# Altium schematic sheet Gremar_FController.SchDoc
size A4; SheetNumber: 1; SheetTotal: 1
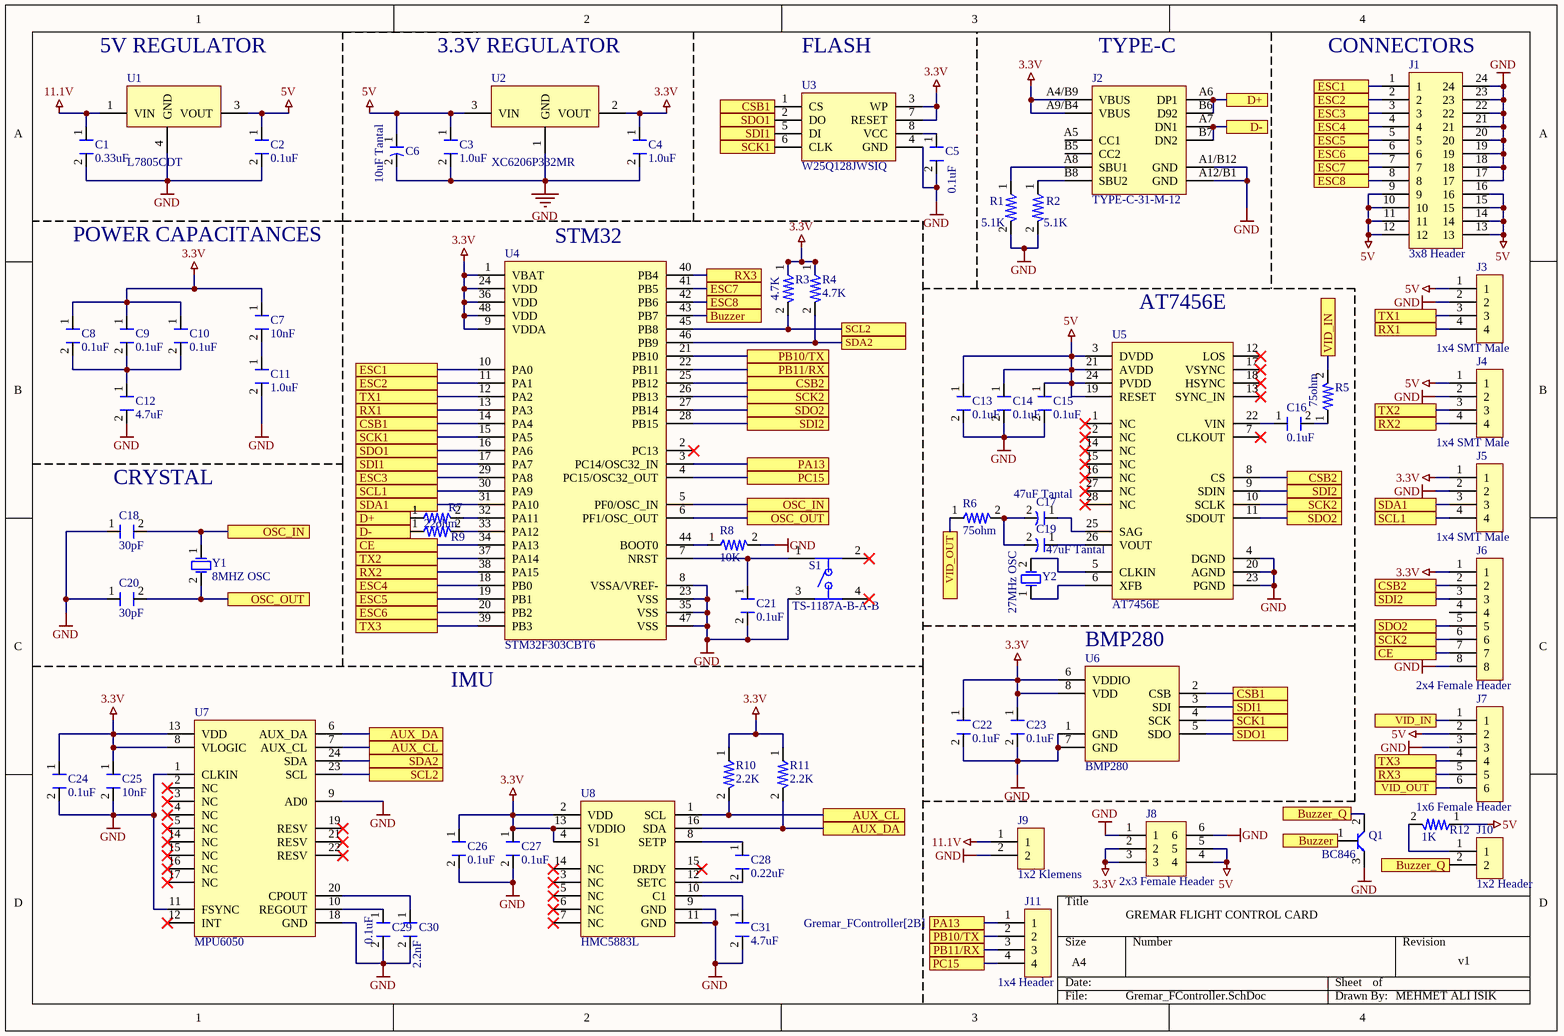
[diagram p0: Gremar_FController.SchDoc]

## Parts
C1  0.33uF  [CAP - 0603]
C2  0.1uF  [CAP - 0603]
C3  1.0uF  [CAP - 0603]
C4  1.0uF  [CAP - 0603]
C5  0.1uF  [CAP - 0603]
C6  10uF Tantal  [10uF Tantal]
C7  10nF  [CAP - 0603]
C8  0.1uF  [CAP - 0603]
C9  0.1uF  [CAP - 0603]
C10  0.1uF  [CAP - 0603]
C11  1.0uF  [CAP - 0603]
C12  4.7uF  [CAP - 0603]
C13  0.1uF  [CAP - 0603]
C14  0.1uF  [CAP - 0603]
C15  0.1uF  [CAP - 0603]
C16  0.1uF  [CAP - 0603]
C17  47uF Tantal  [10uF Tantal]
C18  30pF  [CAP - 0603]
C19  47uF Tantal  [10uF Tantal]
C20  30pF  [CAP - 0603]
C21  0.1uF  [CAP - 0603]
C22  0.1uF  [CAP - 0603]
C23  0.1uF  [CAP - 0603]
C24  0.1uF  [CAP - 0603]
C25  10nF  [CAP - 0603]
C26  0.1uF  [CAP - 0603]
C27  0.1uF  [CAP - 0603]
C28  0.22uF  [CAP - 0603]
C29  0.1uF  [CAP - 0603]
C30  2.2nF  [CAP - 0603]
C31  4.7uF  [CAP - 0603]
J1  3x8 Header  [3x8 Header]
J2  TYPE-C-31-M-12  [TYPE-C-31-M-12]
J3  1x4 SMT Male  [1x4 SMT Header]
J4  1x4 SMT Male  [1x4 SMT Header]
J5  1x4 SMT Male  [1x4 SMT Header]
J6  2x4 Female Header  [2x4 Female Header]
J7  1x6 Female Header  [1x6 FEMALE HEADER]
J8  2x3 Female Header  [2x3 Male Header]
J9  1x2 Klemens  [1x2 Klemens]
J10  1x2 Header  [1x2 Header]
J11  1x4 Header  [1x4 Header]
Q1  BC846  [BC846]
R1  5.1K  [RES - 0603]
R2  5.1K  [RES - 0603]
R3  4.7K  [RES - 0603]
R4  4.7K  [RES - 0603]
R5  75ohm  [RES - 0603]
R6  75ohm  [RES - 0603]
R7  22ohm  [RES - 0603]
R8  10K  [RES - 0603]
R9  22ohm  [RES - 0603]  (value not drawn)
R10  2.2K  [RES - 0603]
R11  2.2K  [RES - 0603]
R12  1K  [RES - 0603]
S1  TS-1187A-B-A-B  [TS-1187A-B-A-B]
U1  L7805CDT  [L7805CDT-TR]
U2  XC6206P332MR  [XC6206P332MR]
U3  W25Q128JWSIQ  [W25Q128JWSIQ]
U4  STM32F303CBT6  [STM32F303CBT6]
U5  AT7456E  [AT7456E]
U6  BMP280  [BMP280]
U7  MPU6050  [MPU-6050]
U8  HMC5883L  [HMC5883L]
Y1  8MHZ OSC  [8MHZ RESONATOR]
Y2  27MHz OSC  [27MHZ OSC - 7A27000010]

## Ports
AUX_CL (see Gremar_FController[1C]), AUX_CL (see Gremar_FController[3D]), AUX_DA (see Gremar_FController[1C]), AUX_DA (see Gremar_FController[3D]), Buzzer (see Gremar_FController[2B]), Buzzer (see Gremar_FController[4D]), Buzzer_Q (see Gremar_FController[4D]), CE (see Gremar_FController[1C]), CE (see Gremar_FController[4C]), CSB1 (see Gremar_FController[1B], Gremar_FController[2A]), CSB1 (see Gremar_FController[1B], Gremar_FController[4C]), CSB1 (see Gremar_FController[2A], Gremar_FController[4C]), CSB2 (see Gremar_FController[2B], Gremar_FController[4B]), CSB2 (see Gremar_FController[2B], Gremar_FController[4C]), CSB2 (see Gremar_FController[4B], Gremar_FController[4C]), D+ (see Gremar_FController[1C]), D+ (see Gremar_FController[4A]), D- (see Gremar_FController[1C]), D- (see Gremar_FController[4A]), ESC1 (see Gremar_FController[1B]), ESC1 (see Gremar_FController[4A]), ESC2 (see Gremar_FController[1B]), ESC2 (see Gremar_FController[4A]), ESC3 (see Gremar_FController[1B]), ESC3 (see Gremar_FController[4A]), ESC4 (see Gremar_FController[1C]), ESC4 (see Gremar_FController[4A]), ESC5 (see Gremar_FController[1C]), ESC5 (see Gremar_FController[4A]), ESC6 (see Gremar_FController[1C]), ESC6 (see Gremar_FController[4A]), ESC7 (see Gremar_FController[2B]), ESC7 (see Gremar_FController[4A]), ESC8 (see Gremar_FController[2B]), ESC8 (see Gremar_FController[4A]), OSC_IN (see Gremar_FController[1C]), OSC_IN (see Gremar_FController[2B]), OSC_OUT (see Gremar_FController[1C]), OSC_OUT (see Gremar_FController[2C]), PA13 (see Gremar_FController[2B]), PA13 (see Gremar_FController[3D]), PB10/TX (see Gremar_FController[2B]), PB10/TX (see Gremar_FController[3D]), PB11/RX (see Gremar_FController[2B]), PB11/RX (see Gremar_FController[3D]), PC15 (see Gremar_FController[2B]), PC15 (see Gremar_FController[3D]), RX1 (see Gremar_FController[1B]), RX1 (see Gremar_FController[4B]), RX2 (see Gremar_FController[1C]), RX2 (see Gremar_FController[4B]), RX3 (see Gremar_FController[2B]), RX3 (see Gremar_FController[4D]), SCK1 (see Gremar_FController[1B], Gremar_FController[2A]), SCK1 (see Gremar_FController[1B], Gremar_FController[4C]), SCK1 (see Gremar_FController[2A], Gremar_FController[4C]), SCK2 (see Gremar_FController[2B], Gremar_FController[4B]), SCK2 (see Gremar_FController[2B], Gremar_FController[4C]), SCK2 (see Gremar_FController[4B], Gremar_FController[4C]), SCL1 (see Gremar_FController[1B]), SCL1 (see Gremar_FController[4C]), SCL2 (see Gremar_FController[1D]), SCL2 (see Gremar_FController[3B]), SDA1 (see Gremar_FController[1B]), SDA1 (see Gremar_FController[4B]), SDA2 (see Gremar_FController[1C]), SDA2 (see Gremar_FController[3B]), SDI1 (see Gremar_FController[1B], Gremar_FController[2A]), SDI1 (see Gremar_FController[1B], Gremar_FController[4C]), SDI1 (see Gremar_FController[2A], Gremar_FController[4C]), SDI2 (see Gremar_FController[2B], Gremar_FController[4B]), SDI2 (see Gremar_FController[2B], Gremar_FController[4C]), SDI2 (see Gremar_FController[4B], Gremar_FController[4C]), SDO1 (see Gremar_FController[1B], Gremar_FController[2A]), SDO1 (see Gremar_FController[1B], Gremar_FController[4C]), SDO1 (see Gremar_FController[2A], Gremar_FController[4C]), SDO2 (see Gremar_FController[2B], Gremar_FController[4C]), SDO2 (see Gremar_FController[4C]), TX1 (see Gremar_FController[1B]), TX1 (see Gremar_FController[4B]), TX2 (see Gremar_FController[1C]), TX2 (see Gremar_FController[4B]), TX3 (see Gremar_FController[1C]), TX3 (see Gremar_FController[4C]), VID_IN (see Gremar_FController[4B]), VID_IN (see Gremar_FController[4C]), VID_OUT (see Gremar_FController[3C]), VID_OUT (see Gremar_FController[4D])

## Nets
3.3V: C4.1 C7.1 C8.1 C9.1 C10.1 C22.1 C23.1 C24.1 C25.1 C26.1 C27.1 J2.A4/B9(VBUS) J2.A9/B4(VBUS) J5.1 J6.1 J8.2 J8.3 R3.1 R4.1 R10.1 R11.1 U2.2(VOUT) U3.3(WP) U3.7(RESET) U4.1(VBAT) U4.9(VDDA) U4.24(VDD) U4.36(VDD) U4.48(VDD) U6.6(VDDIO) U6.8(VDD) U7.8(VLOGIC) U7.13(VDD) U8.2(VDD) U8.4(S1) U8.13(VDDIO)
5V: C2.1 C3.1 C6.1 C13.1 C14.1 C15.1 J1.9 J1.10 J1.11 J1.12 J1.13 J1.14 J1.15 J1.16 J3.1 J4.1 J7.2 J8.4 J8.5 R12.1 U1.3(VOUT) U2.3(VIN) U5.3(DVDD) U5.19(RESET) U5.21(AVDD) U5.24(PVDD)
11.1V: C1.1 J9.1 U1.1(VIN)
GND: C1.2 C2.2 C3.2 C4.2 C5.2 C6.2 C11.2 C12.2 C13.2 C14.2 C15.2 C18.1 C20.1 C21.2 C22.2 C23.2 C24.2 C25.2 C26.2 C27.2 C29.2 C30.2 C31.2 J1.17 J1.18 J1.19 J1.20 J1.21 J1.22 J1.23 J1.24 J2.A1/B12(GND) J2.A12/B1(GND) J3.2 J4.2 J5.2 J6.8 J7.3 J8.1 J8.6 J9.2 Q1.3 R1.2 R2.2 R8.2 S1.3 U1.4(GND) U2.1(GND) U3.4(GND) U4.8(VSSA/VREF-) U4.23(VSS) U4.35(VSS) U4.47(VSS) U5.4(DGND) U5.20(AGND) U5.23(PGND) U6.1(GND) U6.7(GND) U7.1(CLKIN) U7.9(AD0) U7.11(FSYNC) U7.18(GND) U8.9(GND) U8.11(GND)
AUX_CL: R10.2 U7.7(AUX_CL) U8.1(SCL) ; port AUX_CL
AUX_DA: R11.2 U7.6(AUX_DA) U8.16(SDA) ; port AUX_DA
Buzzer: Q1.1 U4.43(PB7) ; port Buzzer
Buzzer_Q: J10.2 Q1.2 ; port Buzzer_Q
CE: J6.7 U4.34(PA13) ; port CE
CSB1: U3.1(CS) U4.14(PA4) U6.2(CSB) ; port CSB1
CSB2: J6.2 U4.25(PB12) U5.8(CS) ; port CSB2
D+: J2.A6(DP1) J2.B6(D92) R7.1 ; port D+
D-: J2.A7(DN1) J2.B7(DN2) R9.1 ; port D-
ESC1: J1.1 U4.10(PA0) ; port ESC1
ESC2: J1.2 U4.11(PA1) ; port ESC2
ESC3: J1.3 U4.29(PA8) ; port ESC3
ESC4: J1.4 U4.18(PB0) ; port ESC4
ESC5: J1.5 U4.19(PB1) ; port ESC5
ESC6: J1.6 U4.20(PB2) ; port ESC6
ESC7: J1.7 U4.41(PB5) ; port ESC7
ESC8: J1.8 U4.42(PB6) ; port ESC8
OSC_IN: C18.2 U4.5(PF0/OSC_IN) Y1.1 ; port OSC_IN
OSC_OUT: C20.2 U4.6(PF1/OSC_OUT) Y1.2 ; port OSC_OUT
PA13: J11.1 U4.3(PC14/OSC32_IN) ; port PA13
PB10/TX: J11.2 U4.21(PB10) ; port PB10/TX
PB11/RX: J11.3 U4.22(PB11) ; port PB11/RX
PC15: J11.4 U4.4(PC15/OSC32_OUT) ; port PC15
RX1: J3.4 U4.13(PA3) ; port RX1
RX2: J4.4 U4.38(PA15) ; port RX2
RX3: J7.5 U4.40(PB4) ; port RX3
SCK1: U3.6(CLK) U4.15(PA5) U6.4(SCK) ; port SCK1
SCK2: J6.6 U4.26(PB13) U5.10(SCLK) ; port SCK2
SCL1: J5.4 U4.30(PA9) ; port SCL1
SCL2: R3.2 U4.45(PB8) U7.23(SCL) ; port SCL2
SDA1: J5.3 U4.31(PA10) ; port SDA1
SDA2: R4.2 U4.46(PB9) U7.24(SDA) ; port SDA2
SDI1: U3.5(DI) U4.17(PA7) U6.3(SDI) ; port SDI1
SDI2: J6.3 U4.28(PB15) U5.9(SDIN) ; port SDI2
SDO1: U3.2(DO) U4.16(PA6) U6.5(SDO) ; port SDO1
SDO2: J6.5 U4.27(PB14) U5.11(SDOUT) ; port SDO2
TX1: J3.3 U4.12(PA2) ; port TX1
TX2: J4.3 U4.37(PA14) ; port TX2
TX3: J7.4 U4.39(PB3) ; port TX3
VID_IN: J7.1 R5.2 ; port VID_IN
VID_OUT: J7.6 R6.1 ; port VID_OUT
NetC5_1: C5.1 U3.8(VCC)
NetC7_2: C7.2 C11.1
NetC8_2: C8.2 C9.2 C10.2 C12.1
NetC16_1: C16.1 U5.22(VIN)
NetC16_2: C16.2 R5.1
NetC17_1: C17.1 U5.25(SAG)
NetC17_2: C17.2 C19.2 R6.2
NetC19_1: C19.1 U5.26(VOUT)
NetC21_1: C21.1 S1.1 U4.7(NRST)
NetC28_1: C28.1 U8.8(SETP)
NetC28_2: C28.2 U8.12(SETC)
NetC29_1: C29.1 U7.10(REGOUT)
NetC30_1: C30.1 U7.20(CPOUT)
NetC31_1: C31.1 U8.10(C1)
NetJ2_A8: J2.A8(SBU1) R1.1
NetJ2_B8: J2.B8(SBU2) R2.1
NetJ10_1: J10.1 R12.2
NetR7_2: R7.2 U4.32(PA11)
NetR8_1: R8.1 U4.44(BOOT0)
NetR9_2: R9.2 U4.33(PA12)
NetU5_5: U5.5(CLKIN) Y2.2
NetU5_6: U5.6(XFB) Y2.1

Not connected (* = marked no-connect by the designer): J2 A5(CC1) B5(CC2); J6 4; S1 2* 4*; U4 2(PC13)*; U5 1(NC)* 2(NC)* 7(CLKOUT)* 12(LOS)* 13(SYNC_IN)* 14(NC)* 15(NC)* 16(NC)* 17(VSYNC)* 18(HSYNC)* 27(NC)* 28(NC)*; U7 2(NC)* 3(NC)* 4(NC)* 5(NC)* 12(INT)* 14(NC)* 15(NC)* 16(NC)* 17(NC)* 19(RESV)* 21(RESV)* 22(RESV)*; U8 3(NC)* 5(NC)* 6(NC)* 7(NC)* 14(NC)* 15(DRDY)*

## Notes on the sheet
- 5V REGULATOR
- 3.3V REGULATOR
- (near U3) FLASH
- (near J2) TYPE-C
- (near J1) CONNECTORS
- POWER CAPACITANCES
- (near U4) STM32
- (near U5) AT7456E
- CRYSTAL
- BMP280
- (near U4) IMU
- (near J8) GREMAR FLIGHT CONTROL CARD
- v1
- MEHMET ALI ISIK

## Library data of the parts
C1 = 0.33uF: 0603 0.33uF Capacitor
C2 C5 C8-C10 C13-C16 C21-C24 C26 C27 C29 = 0.1uF: 0603 0.1uF Capacitor
C3 C4 C11 = 1.0uF: 0603 1.0uF Capacitor
C6 = 10uF Tantal: 10uF 16V 3Ω@100kHz -55℃~+125℃ ±10% CASE-A_3216 Tantalum Capacitors ROHS
C7 C25 = 10nF: 0603 10nF Capacitor
C12 C31 = 4.7uF: 0603 4.7uF Capacitor
C17 C19 = 47uF Tantal: 0603 47uF Capacitor
C18 C20 = 30pF: 0603 30pF Capacitor
C28 = 0.22uF: 0603 0.22uF Capacitor
C30 = 2.2nF: 0603 2.2nF Capacitor
J1 = 3x8 Header: 3x8 Headear 2.54mm
J2 = TYPE-C-31-M-12: 250mA 1 16 Female Type-C SMD USB Connectors ROHS
J3-J5 = 1x4 SMT Male: 1x4 SMT male header
J6 = 2x4 Female Header: 2x4 Female Header 2.54mm
J7 = 1x6 Female Header: 1x6 Female header 2.54mm
J8 = 2x3 Female Header: 2x3 Female header 2.54mm
J10 = 1x2 Header: 1x2 Header 2.54mm
J11 = 1x4 Header: 1x4 Header 2.54mm
Q1 = BC846: SOT-23 NPN Transistor
R1 R2 = 5.1K: 0603 5.1K Resistor
R3 R4 = 4.7K: 0603 4.7K Resistor
R5 R6 = 75ohm: 0603 75ohm Resistor
R7 R9 = 22ohm: 0603 22ohm Resistor
R8 = 10K: 0603 10K Resistor
R10 R11 = 2.2K: 0603 2.2K Resistor
R12 = 1K: 0603 1K Resistor
S1 = TS-1187A-B-A-B: No NO 50mA 5.1mm 100mΩ 100000 160gf 12V -30℃~+85℃ 5.1mm 1.5mm Golden Round Button Brick nogging SPST SMD Tactile Switches ROHS
U1 = L7805CDT: 5V REG, 62dB@(120Hz) 1.5A 2V@(1A) Fixed 5V~5V Positive 1 35V TO-252-3 Linear Voltage Regulators (LDO) ROHS
U2 = XC6206P332MR: 200mA 680mV@(100mA) Fixed 3.3V~3.3V Positive 1 6V SOT-23-3L Linear Voltage Regulators (LDO) ROHS
U3 = W25Q128JWSIQ: SOIC-8_208mil NOR FLASH ROHS
U4 = STM32F303CBT6: ARM® Cortex®-M4 72MHz FLASH 2V ~ 3.6V 32-Bit LQFP-48_7x7x05P ST Microelectronics ROHS
U5 = AT7456E: EEPROM, TSSOP-28 Microcontroller Units (MCUs/MPUs/SOCs) ROHS
U6 = BMP280: LGA-8 Gas Sensors ROHS
U7 = MPU6050: QFN-24_4x4x05P Attitude Sensors ROHSs
U8 = HMC5883L: LCC-16 Magnetic Sensors ROHS
Y1 = 8MHZ OSC: 8MHz ±20ppm 20pF 80Ω SMD-5032_2P SMD Crystal Resonators RoHS
Y2 = 27MHz OSC: 27MHz ±15ppm 20pF 50Ω SMD-5032_2P SMD Crystal Resonators RoHS